# EAGLE schematic KMD-1 (EAGLE 7.0.0)
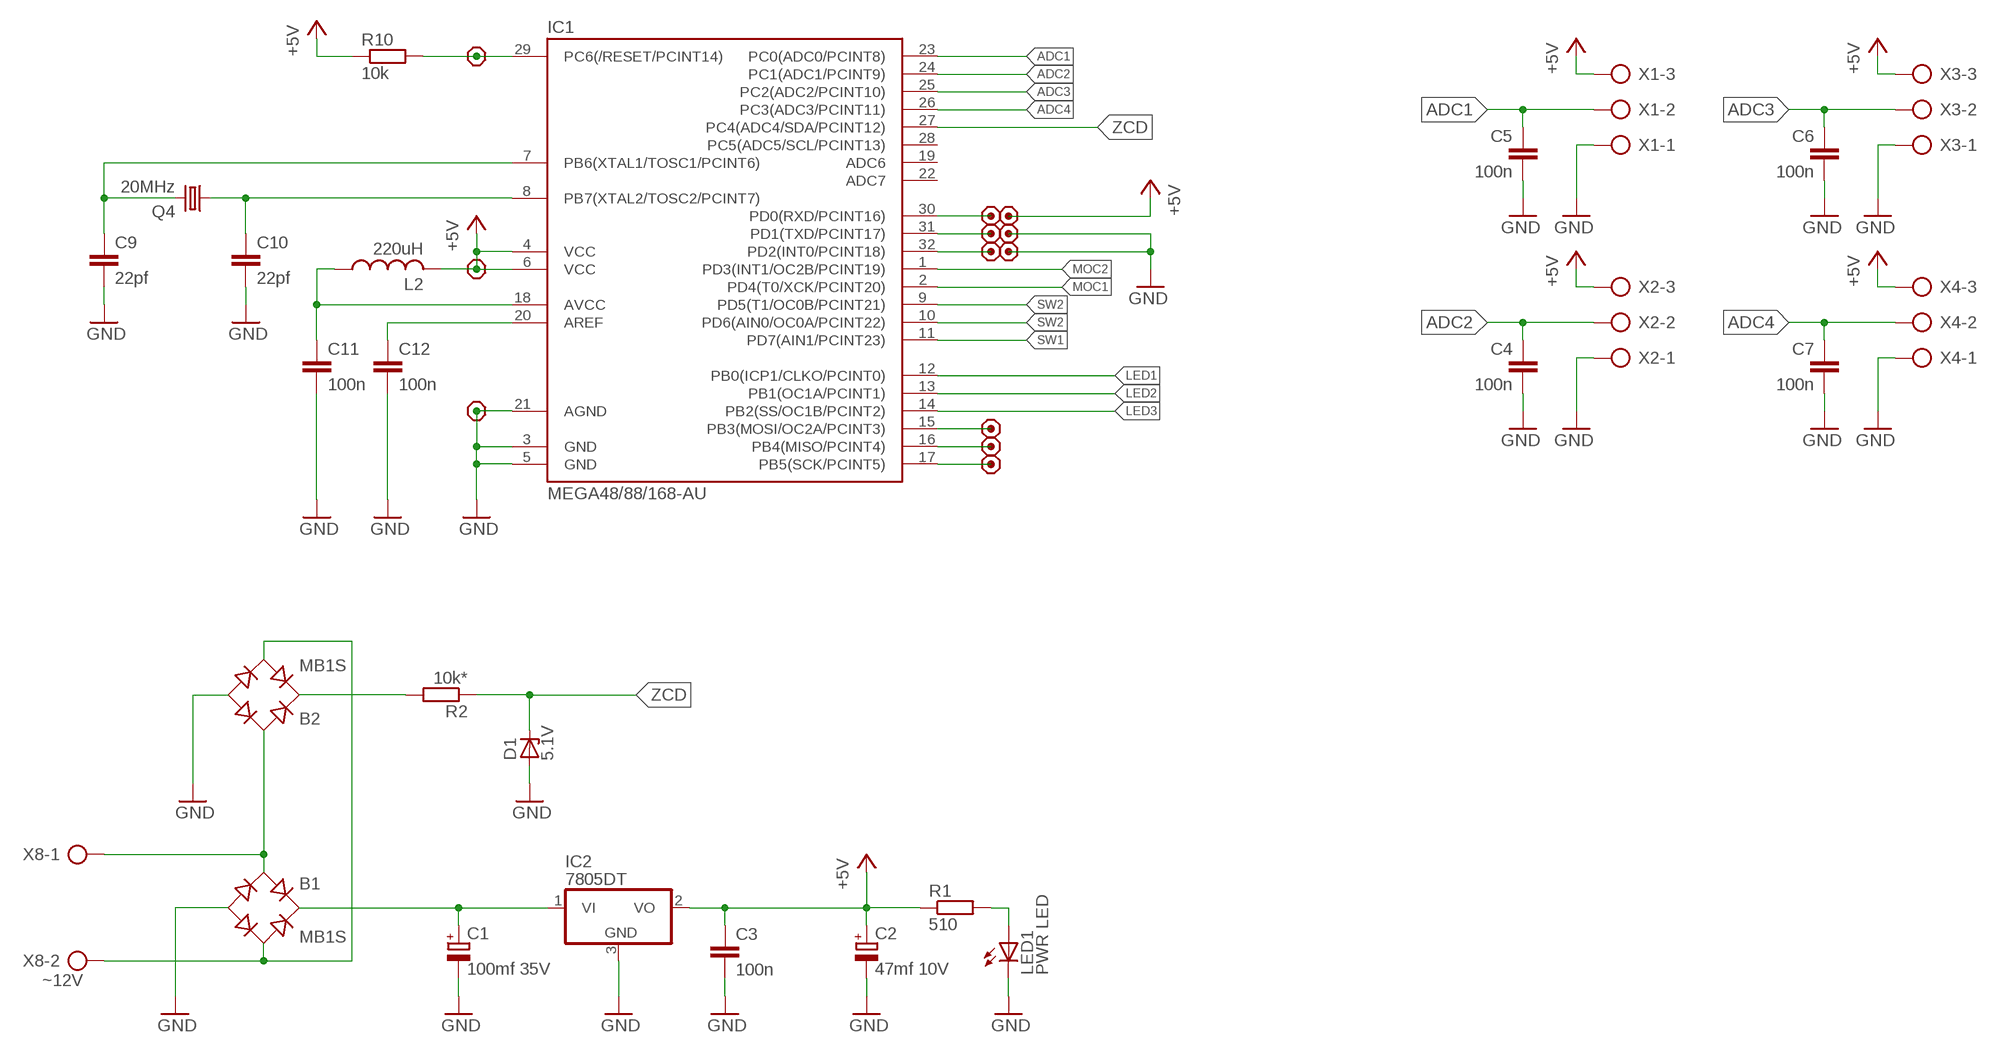
[diagram p0: schematic, sheet 1]

## Parts
B1  MB1S  [SOIC-4]
B2  MB1S  [SOIC-4]
C1  100mf 35V  CPOL-EUE2.5-6  [E2,5-6]
C2  47mf 10V  CPOL-EUE2.5-6  [E2,5-6]
C3  100n  C-EUC0805  [C0805]
C4  100n  C-EUC0805  [C0805]
C5  100n  C-EUC0805  [C0805]
C6  100n  C-EUC0805  [C0805]
C7  100n  C-EUC0805  [C0805]
C9  22pf  C-EUC0805  [C0805]
C10  22pf  C-EUC0805  [C0805]
C11  100n  C-EUC0805  [C0805]
C12  100n  C-EUC0805  [C0805]
D1  5.1V  1N4728  [DO41Z10]
IC1  MEGA48/88/168-AU  [TQFP32-08]
IC2  7805DT  [TO252]
JP1  PIN_1  [1X01]
JP2  PIN_1  [1X01]
JP3  PIN_1  [1X01]
JP4  PIN_1  [1X01]
JP5  PIN_1  [1X01]
JP6  PIN_1  [1X01]
JP7  PIN_1  [1X01]
JP8  PIN_1  [1X01]
JP9  PIN_1  [1X01]
JP10  PIN_1  [1X01]
JP11  PIN_1  [1X01]
JP12  PIN_1  [1X01]
L2  220uH  L-US0207/5V  [0207/5V]
LED1  PWR LED  LED3MM  [LED3MM]
Q4  20MHz  CRYSTALHC49S  [HC49/S]
R1  510  R-EU_M0805  [M0805]
R2  10k*  R-EU_M0805  [M0805]
R10  10k  R-EU_M0805  [M0805]
X1  AK500/3  [AK500/3]
X2  AK500/3  [AK500/3]
X3  AK500/3  [AK500/3]
X4  AK500/3  [AK500/3]
X8  ~12V  AK500/2  [AK500/2]

## Nets
+5V: C2.+ C3.1 IC1.4(VCC) IC1.6(VCC) IC2.2(VO) JP8.1 JP12.1 L2.2 R1.1 R10.1 X1.3 X2.3 X3.3 X4.3
ADC1: C5.1 IC1.23(PC0(ADC0/PCINT8)) X1.2
ADC2: C4.1 IC1.24(PC1(ADC1/PCINT9)) X2.2
ADC3: C6.1 IC1.25(PC2(ADC2/PCINT10)) X3.2
ADC4: C7.1 IC1.26(PC3(ADC3/PCINT11)) X4.2
GND: B1.- B2.- C1.- C2.- C3.2 C4.2 C5.2 C6.2 C7.2 C9.2 C10.2 C11.2 C12.2 D1.A IC1.3(GND) IC1.5(GND) IC1.21(AGND) IC2.3(GND) JP6.1 JP10.1 JP11.1 LED1.K(C) X1.1 X2.1 X3.1 X4.1
LED1: IC1.12(PB0(ICP1/CLKO/PCINT0))
LED2: IC1.13(PB1(OC1A/PCINT1))
LED3: IC1.14(PB2(SS/OC1B/PCINT2))
MOC1: IC1.2(PD4(T0/XCK/PCINT20))
MOC2: IC1.1(PD3(INT1/OC2B/PCINT19))
N$1: LED1.A R1.2
N$2: C9.1 IC1.7(PB6(XTAL1/TOSC1/PCINT6)) Q4.2
N$3: B1.+ C1.+ IC2.1(VI)
N$4: B2.+ R2.2
N$5: IC1.15(PB3(MOSI/OC2A/PCINT3)) JP5.1
N$6: B1.~2(AC2) B2.~2(AC2) X8.2
N$7: C10.1 IC1.8(PB7(XTAL2/TOSC2/PCINT7)) Q4.1
N$8: B1.~1(AC1) B2.~1(AC1) X8.1
N$9: C11.1 IC1.18(AVCC) L2.1
N$10: IC1.16(PB4(MISO/PCINT4)) JP4.1
N$11: IC1.17(PB5(SCK/PCINT5)) JP1.1
N$12: IC1.30(PD0(RXD/PCINT16)) JP3.1
N$13: C12.1 IC1.20(AREF)
N$14: IC1.29(PC6(/RESET/PCINT14)) JP9.1 R10.2
N$15: IC1.31(PD1(TXD/PCINT17)) JP2.1
N$16: IC1.32(PD2(INT0/PCINT18)) JP7.1
SW1: IC1.11(PD7(AIN1/PCINT23))
SW2: IC1.9(PD5(T1/OC0B/PCINT21)) IC1.10(PD6(AIN0/OC0A/PCINT22))
ZCD: D1.C IC1.27(PC4(ADC4/SDA/PCINT12)) R2.1
Unconnected: IC1.19(ADC6) IC1.22(ADC7) IC1.28(PC5(ADC5/SCL/PCINT13))

## Library data of the parts
B1 B2 = rectifier:MB*S: Bridge Rectifier Source: http://www.fairchildsemi.com/ds/MB/MB6S.pdf
C1 C2 = rcl:CPOL-EU: POLARIZED CAPACITOR, European symbol
C3-C7 C9-C12 = rcl:C-EU: CAPACITOR, European symbol
D1 = diode-1:1N4728: Z DIODE 3.3 V, 1W, 5 percent
IC1 = avr-6:MEGA48/88/168
IC2 = linear:78*: Positive VOLTAGE REGULATOR Source: http://cache.national.com/ds/LM/LM78L05.pdf http://www.fairchildsemi.com/ds/LM/LM7805.pdf
JP1-JP12 = pinhead:PIN_1
L2 = rcl:L-US: INDUCTOR, American symbol
LED1 = led:LED: LED OSRAM: - CHIPLED LG R971, LG N971, LY N971, LG Q971, LY Q971, LO R971, LY R971 LH N974, LH R974 LS Q976, LO Q976, LY Q976 LO Q996 - Hyper CHIPLED LW Q18S LB Q993, LB Q99A, LB R99A - SideLED LS A670, LO A670, LY A670, LG A670, LP A670 LB A673, LV A673, LT A673, LW A673 LH A674 LY A675 LS A676, LA A676, LO A676, LY A676, LW A676 LS A679, LY A679, LG A679 - Hyper Micro SIDELED® LS Y876, LA Y876, LO Y876, LY Y876 LT Y87S - SmartLED LW L88C, LW L88S LB L89C, LB L89S, LG L890 LS L89K, LO L89K, LY L89K LS L896, LA L896, LO L896, LY L896 - TOPLED LS T670, LO T670, LY T670, LG T670, LP T670 LSG T670, LSP T670, LSY T670, LOP T670, LYG T670 LG T671, LOG T671, LSG T671 LB T673, LV T673, LT T673, LW T673 LH T674 LS T676, LA T676, LO T676, LY T676, LB T676, LH T676, LSB T676, LW T676 LB T67C, LV T67C, LT T67C, LS T67K, LO T67K, LY T67K, LW E67C LS E67B, LA E67B, LO E67B, LY E67B, LB E67C, LV E67C, LT E67C LW T67C LS T679, LY T679, LG T679 LS T770, LO T770, LY T770, LG T770, LP T770 LB T773, LV T773, LT T773, LW T773 LH T774 LS E675, LA E675, LY E675, LS T675 LS T776, LA T776, LO T776, LY T776, LB T776 LHGB T686 LT T68C, LB T68C - Hyper Mini TOPLED® LB M676 - Mini TOPLED Santana® LG M470 LS M47K, LO M47K, LY M47K Source: http://www.osram.convergy.de LUXEON: - LUMILED® LXK2-PW12-R00, LXK2-PW12-S00, LXK2-PW14-U00, LXK2-PW14-V00 LXK2-PM12-R00, LXK2-PM12-S00, LXK2-PM14-U00 LXK2-PE12-Q00, LXK2-PE12-R00, LXK2-PE12-S00, LXK2-PE14-T00, LXK2-PE14-U00 LXK2-PB12-K00, LXK2-PB12-L00, LXK2-PB12-M00, LXK2-PB14-N00, LXK2-PB14-P00, LXK2-PB14-Q00 LXK2-PR12-L00, LXK2-PR12-M00, LXK2-PR14-Q00, LXK2-PR14-R00 LXK2-PD12-Q00, LXK2-PD12-R00, LXK2-PD12-S00 LXK2-PH12-R00, LXK2-PH12-S00 LXK2-PL12-P00, LXK2-PL12-Q00, LXK2-PL12-R00 Source: www.luxeon.com KINGBRIGHT: KA-3528ASYC Source: www.kingbright.com
Q4 = crystal:CRYSTAL: CRYSTAL; OC_FARNELL: 1667008; OC_NEWARK: unknown
R1 R2 R10 = rcl:R-EU_: RESISTOR, European symbol
X1-X4 = con-ptr500:AK500/3: CONNECTOR; OC_FARNELL: unknown; OC_NEWARK: unknown
X8 = con-ptr500:AK500/2: CONNECTOR; OC_FARNELL: unknown; OC_NEWARK: unknown